# Altium schematic sheet Power - LDO.SchDoc
size A4; SheetNumber: 1; SheetTotal: 2
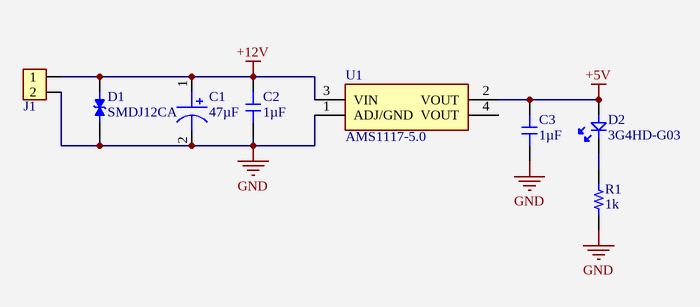
[diagram p0: Power - LDO.SchDoc]

## Parts
C1  47µF  [CAP_63x11x25]
C2  1µF  [0805]
C3  1µF  [0805]
D1  SMDJ12CA  [DIOM6859X262N]
D2  3G4HD-G03  [LED_SSL-LX4673GD-LA20]
J1  691322310002  [WURTH_3_81_691322310002]  (value not drawn)
R1  1k  [0402_RES]
U1  AMS1117-5.0  [SOT229P700X180-4N]

## Nets
+5V: C3.2 D2.A U1.2(VOUT)
+12V: C1.1(+) C2.2 D1.2 J1.1 U1.3(VIN)
GND: C1.2(-) C2.1 C3.1 D1.1 J1.2 R1.1 U1.1(ADJ/GND)
NetD2_C: D2.C R1.2

Not connected (* = marked no-connect by the designer): U1 4(VOUT)

## Notes on the sheet
- Schematic Info
- Title :
- Engineer :
- Date :
- Revision :
- Schematic Of
- of

## Library data of the parts
C1 = PKRM-050V470ME110-T2.5: CAP.EL.47uF 50V 6.3x11 2.5MM 105C TB KOSHIN
C2 C3 = CC0805KKX7R9BB105: MLCC (2012) 0805 1uF 50VDC ±10% X7R
D1 = SMDJ12CA: 150.8A 14.7V 12V SMC ESD and Surge Protection (TVS/ESD) ROHS; MP: SMDJ36CA; Price: None; Availability: Unavailable; Value: *; Package: None
D2 = 3G4HD-G03: LED 3MM GREEN 20mcd 45° GREEN/DIFFUSED; Manufacturer_Name: Lite-On; Manufacturer_Part_Number: LTST-C190KRKT; Datasheet Link: https://componentsearchengine.com/Datasheets/1/LTST-C190KRKT.pdf; Height: 0.8mm; Mouser Part Number: 859-LTST-C190KRKT; Mouser Price/Stock: https://www.mouser.co.uk/ProductDetail/Lite-On/LTST-C190KRKT?qs=kAD5fFa1n5VY3YYNWPC1Fg%3D%3D; Arrow Part Number: LTST-C190KRKT; Arrow Price/Stock: https://www.arrow.com/en/products/ltst-c190krkt/lite-on-technology?region=europe
J1 = 691322310002: WURTH 3.81MM Terminal Block 691322310002
R1 = AC0402FR-071KL: RES.(1005) 0402 1K Ohms 1% 1/16W 100PPM AEC-Q200 S
U1 = AMS1117-5.0: 1A LOW DROPOUT VOLTAGE REGULATOR SOT-223; MF: Advanced Monolithic Systems; Price: None; Availability: Not in stock; Package: SOT-223 Seeed Technology; MP: AMS1117; Value: *; SnapEDA_Link: https://www.snapeda.com/parts/AMS1117/Advanced+Monolithic+Systems/view-part/?ref=snap; Check_prices: https://www.snapeda.com/parts/AMS1117/Advanced+Monolithic+Systems/view-part/?ref=eda